# Altium schematic sheet 5-PadsSeq.SchDoc
size A4
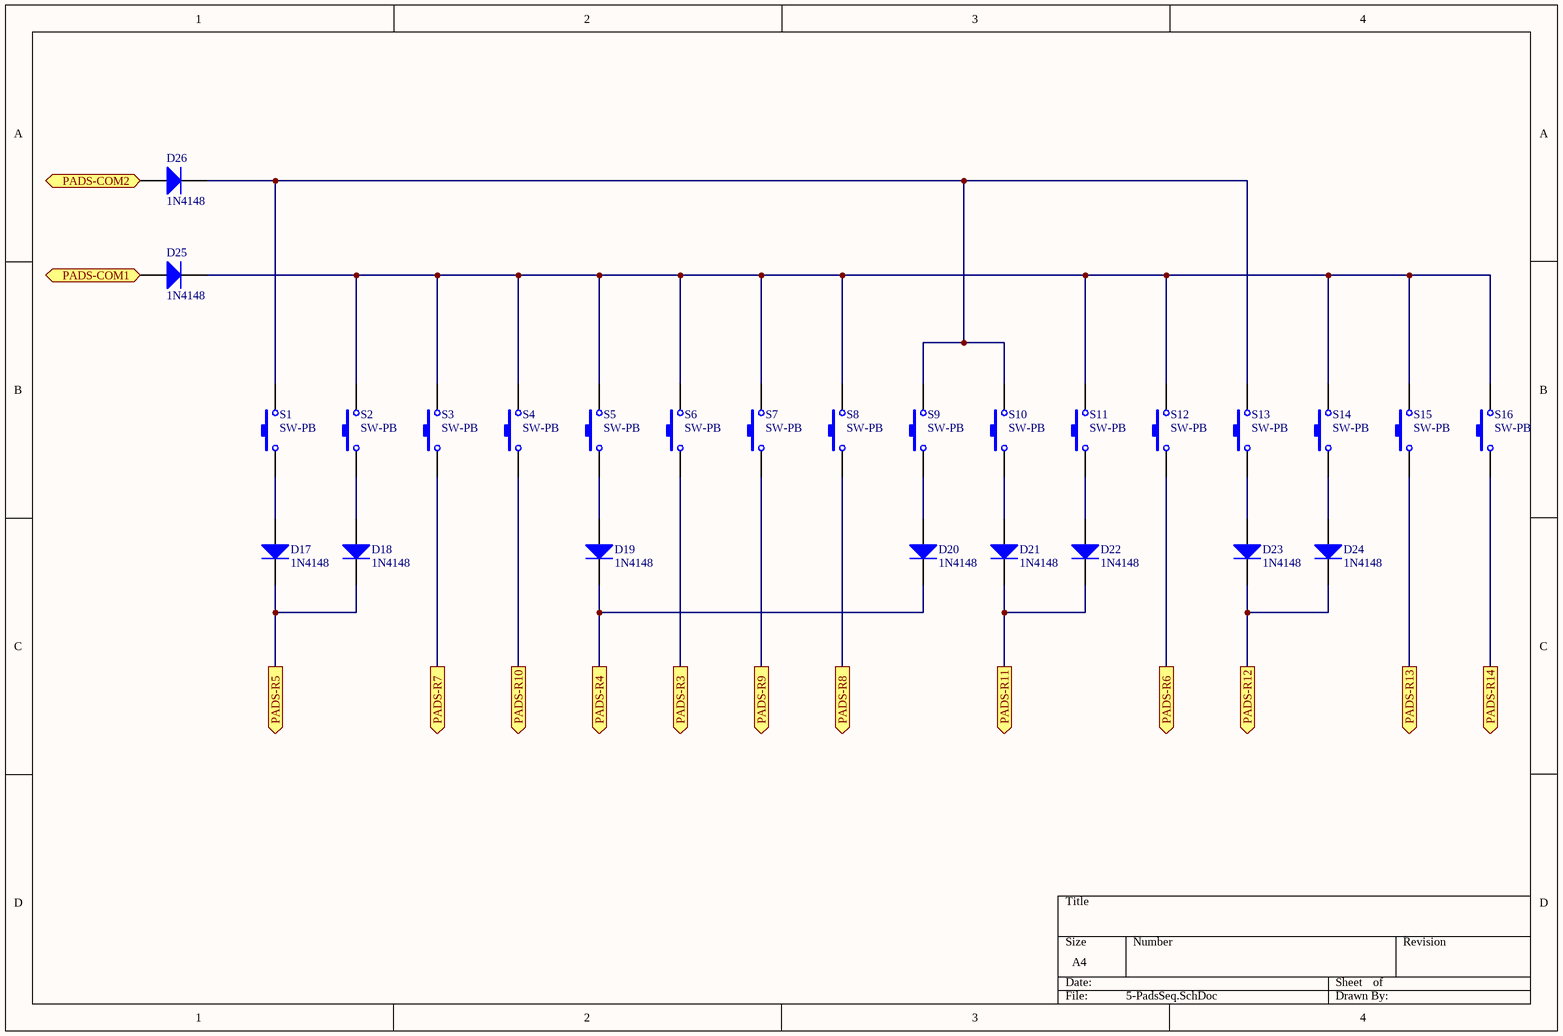
[diagram p0: 5-PadsSeq.SchDoc]

## Parts
D17  1N4148  [SMC]
D18  1N4148  [SMC]
D19  1N4148  [SMC]
D20  1N4148  [SMC]
D21  1N4148  [SMC]
D22  1N4148  [SMC]
D23  1N4148  [SMC]
D24  1N4148  [SMC]
D25  1N4148  [SMC]
D26  1N4148  [SMC]
S1  SW-PB  [SPST-2]
S2  SW-PB  [SPST-2]
S3  SW-PB  [SPST-2]
S4  SW-PB  [SPST-2]
S5  SW-PB  [SPST-2]
S6  SW-PB  [SPST-2]
S7  SW-PB  [SPST-2]
S8  SW-PB  [SPST-2]
S9  SW-PB  [SPST-2]
S10  SW-PB  [SPST-2]
S11  SW-PB  [SPST-2]
S12  SW-PB  [SPST-2]
S13  SW-PB  [SPST-2]
S14  SW-PB  [SPST-2]
S15  SW-PB  [SPST-2]
S16  SW-PB  [SPST-2]

## Ports
PADS-COM1 (in), PADS-COM2 (in), PADS-R3 (out), PADS-R4 (out), PADS-R5 (out), PADS-R6 (out), PADS-R7 (out), PADS-R8 (out), PADS-R9 (out), PADS-R10 (out), PADS-R11 (out), PADS-R12 (out), PADS-R13 (out), PADS-R14 (out)

## Nets
PADS-COM1: D25.1(A) ; port PADS-COM1
PADS-COM2: D26.1(A) ; port PADS-COM2
PADS-R3: S6.1 ; port PADS-R3
PADS-R4: D19.2(K) D20.2(K) ; port PADS-R4
PADS-R5: D17.2(K) D18.2(K) ; port PADS-R5
PADS-R6: S12.1 ; port PADS-R6
PADS-R7: S3.1 ; port PADS-R7
PADS-R8: S8.1 ; port PADS-R8
PADS-R9: S7.1 ; port PADS-R9
PADS-R10: S4.1 ; port PADS-R10
PADS-R11: D21.2(K) D22.2(K) ; port PADS-R11
PADS-R12: D23.2(K) D24.2(K) ; port PADS-R12
PADS-R13: S15.1 ; port PADS-R13
PADS-R14: S16.1 ; port PADS-R14
NetD17_1: D17.1(A) S1.1
NetD18_1: D18.1(A) S2.1
NetD19_1: D19.1(A) S5.1
NetD20_1: D20.1(A) S9.1
NetD21_1: D21.1(A) S10.1
NetD22_1: D22.1(A) S11.1
NetD23_1: D23.1(A) S13.1
NetD24_1: D24.1(A) S14.1
NetD25_2: D25.2(K) S2.2 S3.2 S4.2 S5.2 S6.2 S7.2 S8.2 S11.2 S12.2 S14.2 S15.2 S16.2
NetD26_2: D26.2(K) S1.2 S9.2 S10.2 S13.2

## Library data of the parts
D17-D26 = Diode: Default Diode; Published: 8-Jun-2000; LatestRevisionDate: 17-Jul-2002; LatestRevisionNote: Re-released for DXP Platform.; PackageVersion: Sep-1996; PackageReference: SMC; Publisher: Altium Limited; PackageDescription: DO-214-AB/SMC; 2 C-Bend Leads; Body 7.9 x 5.9 mm, inc. leads (LxW); Code_JEDEC: DO-214-AB
S1-S16 = SW-PB: Switch; Published: 24-Mar-1999; LatestRevisionDate: 17-Jul-2002; LatestRevisionNote: Re-released for DXP Platform.; PackageReference: SPST-2; Publisher: Altium Limited; PackageDescription: Switch; 2 Leads